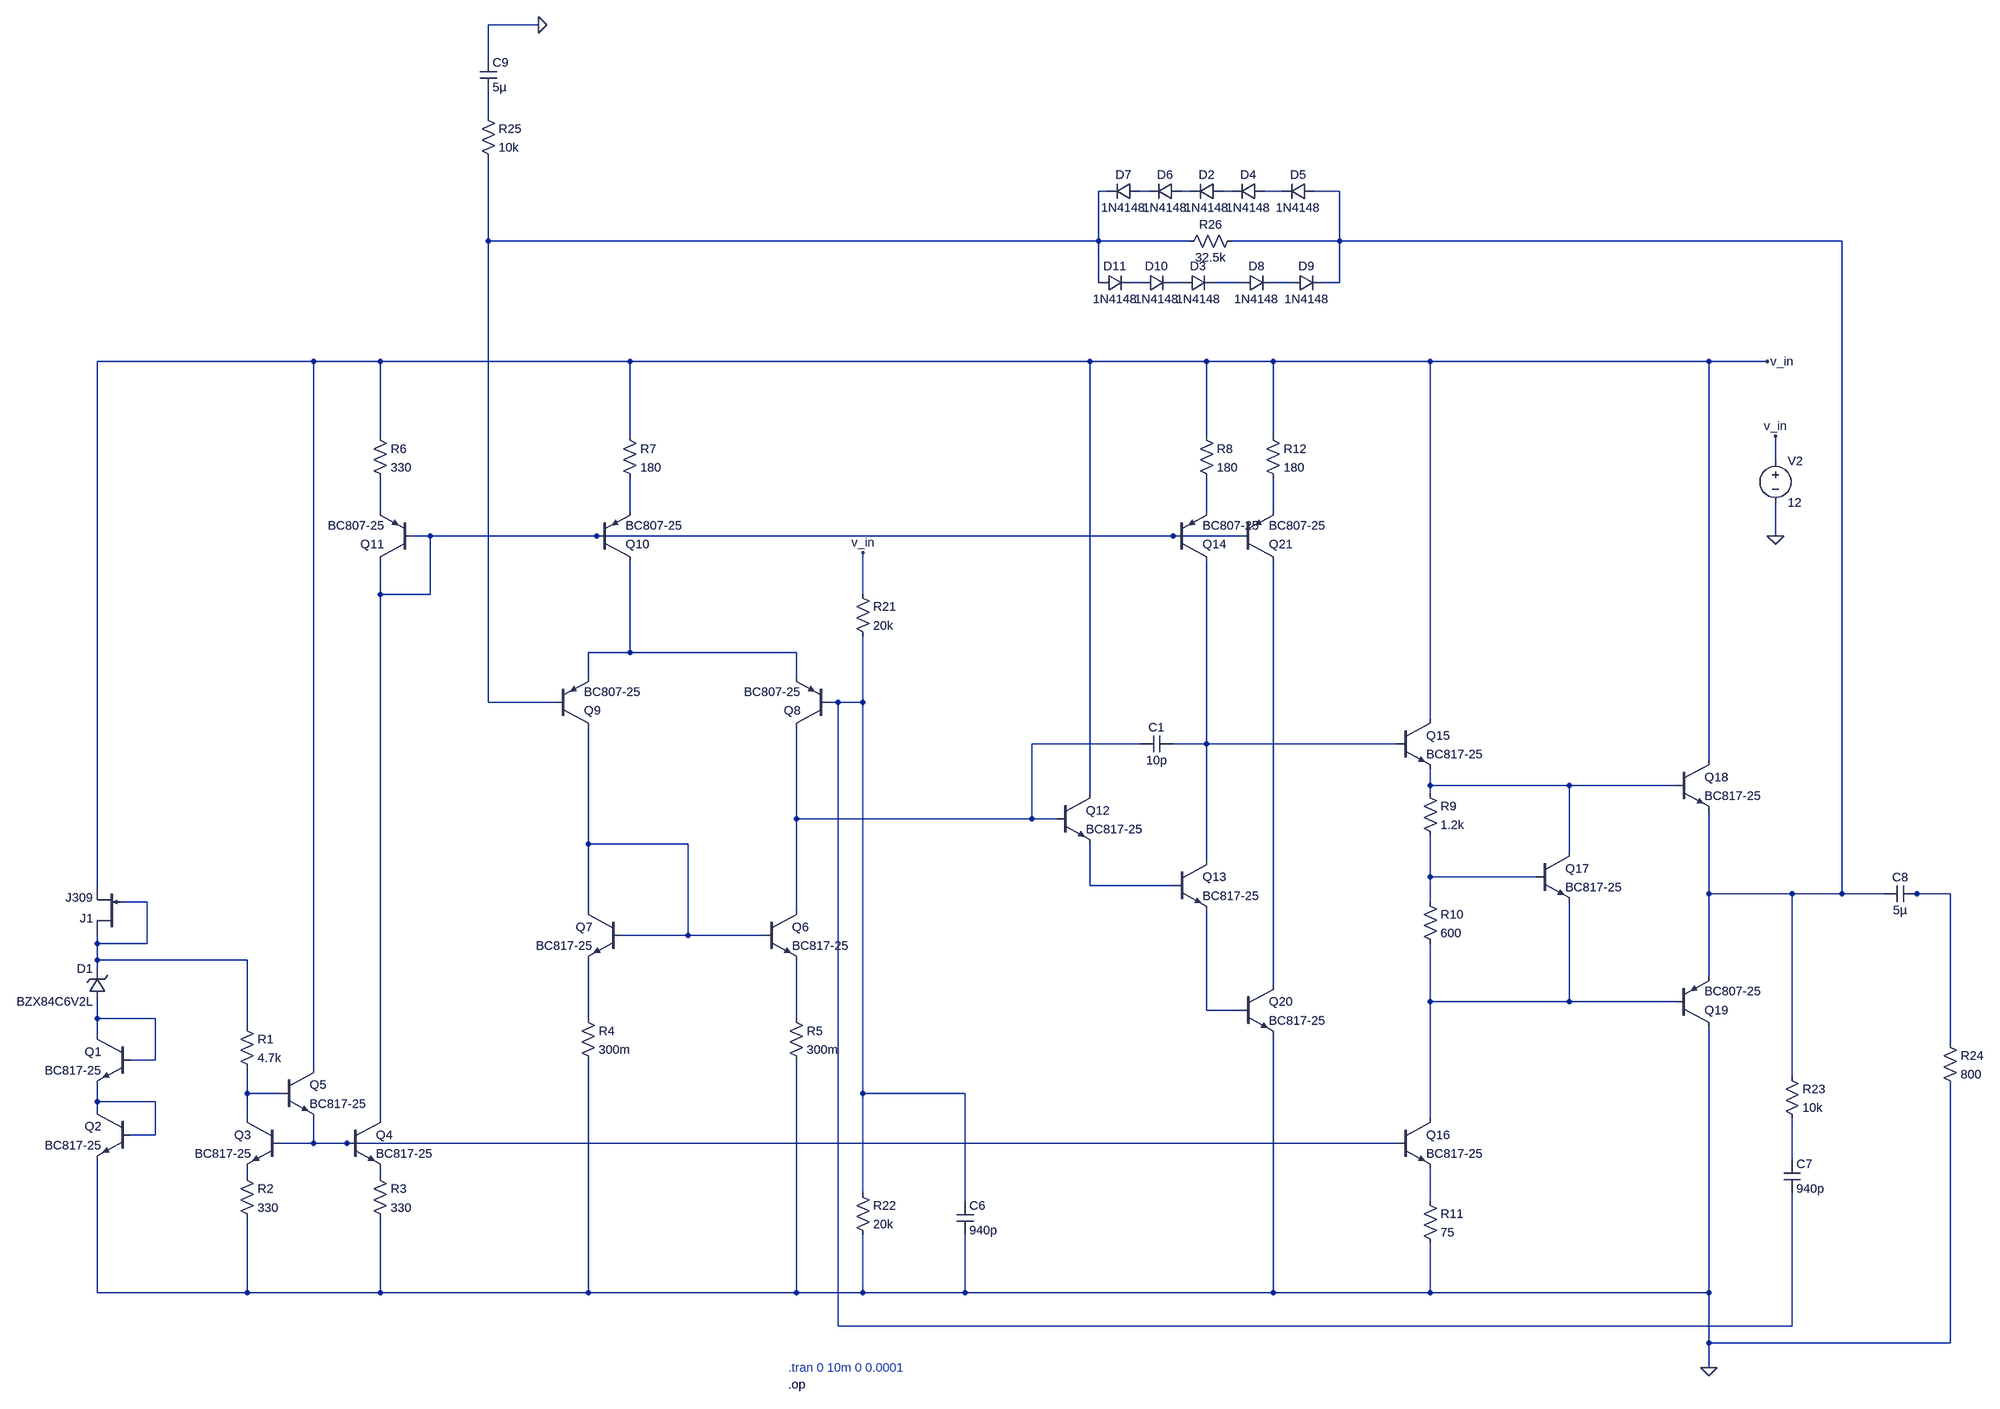
[diagram p0: schematic Wien_oscilator.asc]
Wien_oscilator.asc, the LTspice schematic file:
Version 4.1
SHEET 1 3988 2692
WIRE 928 -1648 832 -1648
WIRE 832 -1584 832 -1648
WIRE 832 -1472 832 -1520
WIRE 2064 -1328 2048 -1328
WIRE 2144 -1328 2128 -1328
WIRE 2224 -1328 2208 -1328
WIRE 2304 -1328 2288 -1328
WIRE 2400 -1328 2368 -1328
WIRE 2512 -1328 2464 -1328
WIRE 832 -1232 832 -1392
WIRE 2048 -1232 2048 -1328
WIRE 2048 -1232 832 -1232
WIRE 2224 -1232 2048 -1232
WIRE 2512 -1232 2512 -1328
WIRE 2512 -1232 2304 -1232
WIRE 3696 -1232 2512 -1232
WIRE 2048 -1152 2048 -1232
WIRE 2128 -1152 2112 -1152
WIRE 2208 -1152 2192 -1152
WIRE 2320 -1152 2272 -1152
WIRE 2416 -1152 2384 -1152
WIRE 2512 -1152 2512 -1232
WIRE 2512 -1152 2480 -1152
WIRE 496 -944 80 -944
WIRE 624 -944 496 -944
WIRE 1104 -944 624 -944
WIRE 2032 -944 1104 -944
WIRE 2256 -944 2032 -944
WIRE 2384 -944 2256 -944
WIRE 2736 -944 2384 -944
WIRE 3440 -944 2736 -944
WIRE 3552 -944 3440 -944
WIRE 624 -800 624 -944
WIRE 1104 -800 1104 -944
WIRE 2256 -800 2256 -944
WIRE 2384 -800 2384 -944
WIRE 3568 -752 3568 -800
WIRE 624 -656 624 -720
WIRE 1104 -656 1104 -720
WIRE 2256 -656 2256 -720
WIRE 2384 -656 2384 -720
WIRE 720 -608 688 -608
WIRE 1040 -608 720 -608
WIRE 2192 -608 1040 -608
WIRE 2320 -608 2192 -608
WIRE 3568 -608 3568 -672
WIRE 624 -496 624 -560
WIRE 720 -496 720 -608
WIRE 720 -496 624 -496
WIRE 1552 -496 1552 -576
WIRE 1104 -384 1104 -560
WIRE 1104 -384 1024 -384
WIRE 1424 -384 1104 -384
WIRE 1024 -336 1024 -384
WIRE 1424 -336 1424 -384
WIRE 832 -288 832 -1232
WIRE 960 -288 832 -288
WIRE 1504 -288 1488 -288
WIRE 1552 -288 1552 -416
WIRE 1552 -288 1504 -288
WIRE 2736 -256 2736 -944
WIRE 2128 -208 1920 -208
WIRE 2256 -208 2256 -560
WIRE 2256 -208 2192 -208
WIRE 2672 -208 2256 -208
WIRE 3440 -176 3440 -944
WIRE 2736 -128 2736 -160
WIRE 3152 -128 2736 -128
WIRE 3376 -128 3152 -128
WIRE 2032 -112 2032 -944
WIRE 2736 -112 2736 -128
WIRE 1424 -64 1424 -240
WIRE 1920 -64 1920 -208
WIRE 1920 -64 1424 -64
WIRE 1968 -64 1920 -64
WIRE 1024 -16 1024 -240
WIRE 1216 -16 1024 -16
WIRE 3152 0 3152 -128
WIRE 2256 16 2256 -208
WIRE 2736 48 2736 -32
WIRE 3088 48 2736 48
WIRE 80 64 80 -944
WIRE 2032 64 2032 -16
WIRE 2192 64 2032 64
WIRE 3440 80 3440 -80
WIRE 3600 80 3440 80
WIRE 3696 80 3696 -1232
WIRE 3696 80 3600 80
WIRE 3776 80 3696 80
WIRE 3840 80 3824 80
WIRE 3904 80 3840 80
WIRE 176 96 128 96
WIRE 2736 96 2736 48
WIRE 1024 112 1024 -16
WIRE 1424 112 1424 -64
WIRE 1216 160 1216 -16
WIRE 1216 160 1088 160
WIRE 1360 160 1216 160
WIRE 80 176 80 160
WIRE 176 176 176 96
WIRE 176 176 80 176
WIRE 80 208 80 176
WIRE 368 208 80 208
WIRE 80 224 80 208
WIRE 3440 240 3440 80
WIRE 2384 256 2384 -560
WIRE 2736 288 2736 176
WIRE 3152 288 3152 96
WIRE 3152 288 2736 288
WIRE 3376 288 3152 288
WIRE 2256 304 2256 112
WIRE 2320 304 2256 304
WIRE 80 320 80 288
WIRE 192 320 80 320
WIRE 1024 320 1024 208
WIRE 1424 320 1424 208
WIRE 368 336 368 208
WIRE 80 352 80 320
WIRE 3904 368 3904 80
WIRE 192 400 192 320
WIRE 192 400 144 400
WIRE 496 416 496 -944
WIRE 3600 432 3600 80
WIRE 368 464 368 416
WIRE 432 464 368 464
WIRE 1552 464 1552 -288
WIRE 1792 464 1552 464
WIRE 80 480 80 448
WIRE 192 480 80 480
WIRE 80 496 80 480
WIRE 368 512 368 464
WIRE 624 512 624 -496
WIRE 2736 512 2736 288
WIRE 192 544 192 480
WIRE 192 544 144 544
WIRE 496 560 496 512
WIRE 496 560 432 560
WIRE 560 560 496 560
WIRE 2672 560 560 560
WIRE 3600 592 3600 512
WIRE 368 624 368 608
WIRE 624 624 624 608
WIRE 1552 656 1552 464
WIRE 1792 672 1792 464
WIRE 2736 672 2736 608
WIRE 80 848 80 592
WIRE 368 848 368 704
WIRE 368 848 80 848
WIRE 624 848 624 704
WIRE 624 848 368 848
WIRE 1024 848 1024 400
WIRE 1024 848 624 848
WIRE 1424 848 1424 400
WIRE 1424 848 1024 848
WIRE 1552 848 1552 736
WIRE 1552 848 1424 848
WIRE 1792 848 1792 736
WIRE 1792 848 1552 848
WIRE 2384 848 2384 352
WIRE 2384 848 1792 848
WIRE 2736 848 2736 752
WIRE 2736 848 2384 848
WIRE 3440 848 3440 336
WIRE 3440 848 2736 848
WIRE 1504 912 1504 -288
WIRE 3600 912 3600 656
WIRE 3600 912 1504 912
WIRE 3440 944 3440 848
WIRE 3904 944 3904 448
WIRE 3904 944 3440 944
WIRE 3440 992 3440 944
FLAG 3552 -944 v_in
FLAG 3440 992 0
FLAG 3568 -608 0
FLAG 3568 -800 v_in
FLAG 1552 -576 v_in
FLAG 928 -1648 0
DATAFLAG 1104 -880 ""
DATAFLAG 2032 -864 ""
DATAFLAG 80 -416 ""
DATAFLAG 160 208 ""
DATAFLAG 176 96 ""
DATAFLAG 128 320 ""
DATAFLAG 80 464 ""
DATAFLAG 160 480 ""
DATAFLAG 80 672 ""
DATAFLAG 480 560 ""
DATAFLAG 400 464 ""
DATAFLAG 496 288 ""
DATAFLAG 624 752 ""
DATAFLAG 368 752 ""
DATAFLAG 624 624 ""
DATAFLAG 624 464 ""
DATAFLAG 624 -464 ""
DATAFLAG 784 -608 ""
DATAFLAG 1104 -512 ""
DATAFLAG 1104 -704 ""
DATAFLAG 624 -688 ""
DATAFLAG 1776 -608 ""
DATAFLAG 1552 -336 ""
DATAFLAG 1792 512 ""
DATAFLAG 1552 528 ""
DATAFLAG 2176 560 ""
DATAFLAG 2384 432 ""
DATAFLAG 1888 912 ""
DATAFLAG 1424 720 ""
DATAFLAG 1024 656 ""
DATAFLAG 1024 -128 ""
DATAFLAG 1424 -160 ""
DATAFLAG 1424 32 ""
DATAFLAG 1216 32 ""
DATAFLAG 1264 160 ""
DATAFLAG 2560 -208 ""
DATAFLAG 2384 -368 ""
DATAFLAG 2256 -368 ""
DATAFLAG 2256 -848 ""
DATAFLAG 2384 -864 ""
DATAFLAG 2736 -448 ""
DATAFLAG 3152 -64 ""
DATAFLAG 3152 224 ""
DATAFLAG 2736 400 ""
DATAFLAG 3440 -432 ""
DATAFLAG 3696 -416 ""
DATAFLAG 3904 224 ""
DATAFLAG 3504 80 ""
DATAFLAG 3600 224 ""
DATAFLAG 3440 512 ""
DATAFLAG 3440 -16 ""
DATAFLAG 3440 160 ""
DATAFLAG 832 -1312 ""
DATAFLAG 1216 -1232 ""
DATAFLAG 2832 -1232 ""
DATAFLAG 80 192 ""
SYMBOL njf 128 160 R180
SYMATTR InstName J1
SYMATTR Value J309
SYMBOL zener 96 288 R180
WINDOW 0 24 64 Left 2
WINDOW 3 24 0 Left 2
SYMATTR InstName D1
SYMATTR Value BZX84C6V2L
SYMBOL npn 144 352 M0
SYMATTR InstName Q1
SYMATTR Value BC817-25
SYMBOL npn 144 496 M0
SYMATTR InstName Q2
SYMATTR Value BC817-25
SYMBOL res 352 320 R0
SYMATTR InstName R1
SYMATTR Value 4.7k
SYMBOL res 352 608 R0
SYMATTR InstName R2
SYMATTR Value 330
SYMBOL res 608 608 R0
SYMATTR InstName R3
SYMATTR Value 330
SYMBOL npn 432 512 M0
SYMATTR InstName Q3
SYMATTR Value BC817-25
SYMBOL npn 560 512 R0
SYMATTR InstName Q4
SYMATTR Value BC817-25
SYMBOL npn 432 416 R0
SYMATTR InstName Q5
SYMATTR Value BC817-25
SYMBOL res 1008 304 R0
SYMATTR InstName R4
SYMATTR Value 300m
SYMBOL res 1408 304 R0
SYMATTR InstName R5
SYMATTR Value 300m
SYMBOL npn 1360 112 R0
SYMATTR InstName Q6
SYMATTR Value BC817-25
SYMBOL npn 1088 112 M0
SYMATTR InstName Q7
SYMATTR Value BC817-25
SYMBOL pnp 1488 -240 R180
SYMATTR InstName Q8
SYMATTR Value BC807-25
SYMBOL pnp 960 -240 M180
SYMATTR InstName Q9
SYMATTR Value BC807-25
SYMBOL pnp 1040 -560 M180
SYMATTR InstName Q10
SYMATTR Value BC807-25
SYMBOL pnp 688 -560 R180
SYMATTR InstName Q11
SYMATTR Value BC807-25
SYMBOL res 608 -816 R0
SYMATTR InstName R6
SYMATTR Value 330
SYMBOL res 1088 -816 R0
SYMATTR InstName R7
SYMATTR Value 180
SYMBOL npn 1968 -112 R0
SYMATTR InstName Q12
SYMATTR Value BC817-25
SYMBOL npn 2192 16 R0
SYMATTR InstName Q13
SYMATTR Value BC817-25
SYMBOL pnp 2192 -560 M180
SYMATTR InstName Q14
SYMATTR Value BC807-25
SYMBOL res 2240 -816 R0
SYMATTR InstName R8
SYMATTR Value 180
SYMBOL cap 2192 -224 R90
WINDOW 0 0 32 VBottom 2
WINDOW 3 32 32 VTop 2
SYMATTR InstName C1
SYMATTR Value 10p
SYMBOL npn 2672 -256 R0
SYMATTR InstName Q15
SYMATTR Value BC817-25
SYMBOL res 2720 -128 R0
SYMATTR InstName R9
SYMATTR Value 1.2k
SYMBOL res 2720 80 R0
SYMATTR InstName R10
SYMATTR Value 600
SYMBOL npn 2672 512 R0
SYMATTR InstName Q16
SYMATTR Value BC817-25
SYMBOL res 2720 656 R0
SYMATTR InstName R11
SYMATTR Value 75
SYMBOL npn 3088 0 R0
SYMATTR InstName Q17
SYMATTR Value BC817-25
SYMBOL npn 3376 -176 R0
SYMATTR InstName Q18
SYMATTR Value BC817-25
SYMBOL pnp 3376 336 M180
SYMATTR InstName Q19
SYMATTR Value BC807-25
SYMBOL npn 2320 256 R0
SYMATTR InstName Q20
SYMATTR Value BC817-25
SYMBOL pnp 2320 -560 M180
SYMATTR InstName Q21
SYMATTR Value BC807-25
SYMBOL res 2368 -816 R0
SYMATTR InstName R12
SYMATTR Value 180
SYMBOL voltage 3568 -768 R0
WINDOW 123 0 0 Left 0
WINDOW 39 0 0 Left 0
SYMATTR InstName V2
SYMATTR Value 12
SYMBOL res 1536 -512 R0
SYMATTR InstName R21
SYMATTR Value 20k
SYMBOL res 1536 640 R0
SYMATTR InstName R22
SYMATTR Value 20k
SYMBOL cap 1776 672 R0
SYMATTR InstName C6
SYMATTR Value 940p
SYMBOL cap 3584 592 R0
SYMATTR InstName C7
SYMATTR Value 940p
SYMBOL res 3584 416 R0
SYMATTR InstName R23
SYMATTR Value 10k
SYMBOL cap 3840 64 R90
WINDOW 0 0 32 VBottom 2
WINDOW 3 32 32 VTop 2
SYMATTR InstName C8
SYMATTR Value 5µ
SYMBOL res 3888 352 R0
SYMATTR InstName R24
SYMATTR Value 800
SYMBOL res 816 -1488 R0
SYMATTR InstName R25
SYMATTR Value 10k
SYMBOL cap 816 -1584 R0
SYMATTR InstName C9
SYMATTR Value 5µ
SYMBOL res 2320 -1248 R90
WINDOW 0 0 56 VBottom 2
WINDOW 3 32 56 VTop 2
SYMATTR InstName R26
SYMATTR Value 32.5k
SYMBOL diode 2288 -1344 R90
WINDOW 0 0 32 VBottom 2
WINDOW 3 32 32 VTop 2
SYMATTR InstName D2
SYMATTR Value 1N4148
SYMBOL diode 2208 -1136 R270
WINDOW 0 32 32 VTop 2
WINDOW 3 0 32 VBottom 2
SYMATTR InstName D3
SYMATTR Value 1N4148
SYMBOL diode 2368 -1344 R90
WINDOW 0 0 32 VBottom 2
WINDOW 3 32 32 VTop 2
SYMATTR InstName D4
SYMATTR Value 1N4148
SYMBOL diode 2464 -1344 R90
WINDOW 0 0 32 VBottom 2
WINDOW 3 32 32 VTop 2
SYMATTR InstName D5
SYMATTR Value 1N4148
SYMBOL diode 2208 -1344 R90
WINDOW 0 0 32 VBottom 2
WINDOW 3 32 32 VTop 2
SYMATTR InstName D6
SYMATTR Value 1N4148
SYMBOL diode 2128 -1344 R90
WINDOW 0 0 32 VBottom 2
WINDOW 3 32 32 VTop 2
SYMATTR InstName D7
SYMATTR Value 1N4148
SYMBOL diode 2320 -1136 R270
WINDOW 0 32 32 VTop 2
WINDOW 3 0 32 VBottom 2
SYMATTR InstName D8
SYMATTR Value 1N4148
SYMBOL diode 2416 -1136 R270
WINDOW 0 32 32 VTop 2
WINDOW 3 0 32 VBottom 2
SYMATTR InstName D9
SYMATTR Value 1N4148
SYMBOL diode 2128 -1136 R270
WINDOW 0 32 32 VTop 2
WINDOW 3 0 32 VBottom 2
SYMATTR InstName D10
SYMATTR Value 1N4148
SYMBOL diode 2048 -1136 R270
WINDOW 0 32 32 VTop 2
WINDOW 3 0 32 VBottom 2
SYMATTR InstName D11
SYMATTR Value 1N4148
TEXT 1408 992 Left 2 ;.tran 0 10m 0 0.0001
TEXT 1408 1024 Left 2 !.op

The netlist it stands for:
* Wien_oscilator.asc
J1 N026 N026 v_in J309
D1 N030 N026 BZX84C6V2L
Q1 N030 N030 N034 0 BC817-25
Q2 N034 N034 0 0 BC817-25
R1 N026 N033 4.7k
R2 N037 0 330
R3 N038 0 330
Q3 N033 N035 N037 0 BC817-25
Q4 N016 N035 N038 0 BC817-25
Q5 v_in N033 N035 0 BC817-25
R4 N031 0 300m
R5 N032 0 300m
Q6 N019 N022 N032 0 BC817-25
Q7 N022 N022 N031 0 BC817-25
Q8 N019 N018 N017 0 BC807-25
Q9 N022 N002 N017 0 BC807-25
Q10 N017 N016 N013 0 BC807-25
Q11 N016 N016 N012 0 BC807-25
R6 v_in N012 330
R7 v_in N013 180
Q12 v_in N019 N024 0 BC817-25
Q13 N020 N024 N029 0 BC817-25
Q14 N020 N016 N014 0 BC807-25
R8 v_in N014 180
C1 N020 N019 10p
Q15 v_in N020 N021 0 BC817-25
R9 N021 N023 1.2k
R10 N023 N028 600
Q16 N028 N035 N039 0 BC817-25
R11 N039 0 75
Q17 N021 N023 N028 0 BC817-25
Q18 v_in N021 N007 0 BC817-25
Q19 0 N028 N007 0 BC807-25
Q20 N027 N029 0 0 BC817-25
Q21 N027 N016 N015 0 BC807-25
R12 v_in N015 180
V2 v_in 0 12
R21 v_in N018 20k
R22 N018 0 20k
C6 N018 0 940p
C7 N036 N018 940p
R23 N007 N036 10k
C8 N025 N007 5µ
R24 N025 0 800
R25 N001 N002 10k
C9 0 N001 5µ
R26 N007 N002 32.5k
D2 N005 N004 1N4148
D3 N009 N010 1N4148
D4 N006 N005 1N4148
D5 N007 N006 1N4148
D6 N004 N003 1N4148
D7 N003 N002 1N4148
D8 N010 N011 1N4148
D9 N011 N007 1N4148
D10 N008 N009 1N4148
D11 N002 N008 1N4148
.model D D
.lib standard.dio
.model NPN NPN
.model PNP PNP
.lib standard.bjt
.model NJF NJF
.model PJF PJF
.lib standard.jft
* .tran 0 10m 0 0.0001
.op
.backanno
.end